# Altium schematic sheet Sheet.SchDoc
size A4; SheetNumber: 1; SheetTotal: 1
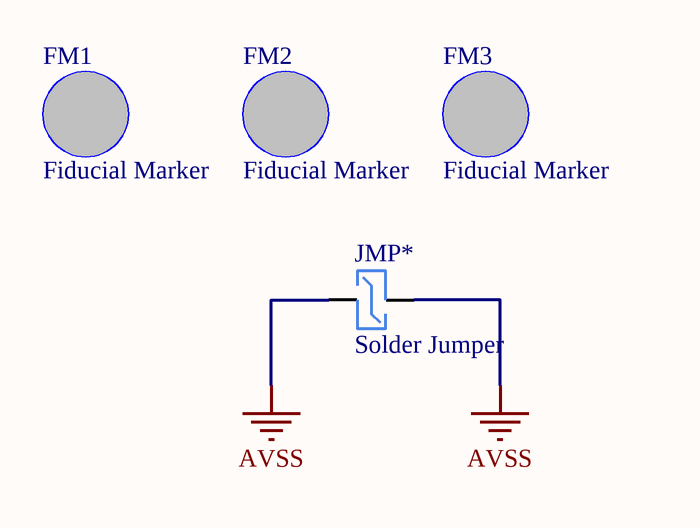
[diagram p0: Sheet.SchDoc]

## Parts
FM1  Fiducial Marker  [Fiducial Marker-Footprint-1]
FM2  Fiducial Marker  [Fiducial Marker-Footprint-1]
FM3  Fiducial Marker  [Fiducial Marker-Footprint-1]
JMP*  Solder Jumper  [Solder Jumper-Footprint-1]

## Nets
AVSS: JMP*.1 JMP*.2

## Library data of the parts
FM1-FM3 = CMP-00003-4: fancy style
JMP* = CMP-00000-3: 2 port solder jumper